# Altium schematic sheet SOC Power Pins.SchDoc: RK3399 SOM Module
size A3; Date: 23.05.2023; Author: Łukasz Nowarkiewicz; SheetNumber: 6; SheetTotal: 21; RegistrationBookNumber: 144201; title_sheet: SOC Power Pins
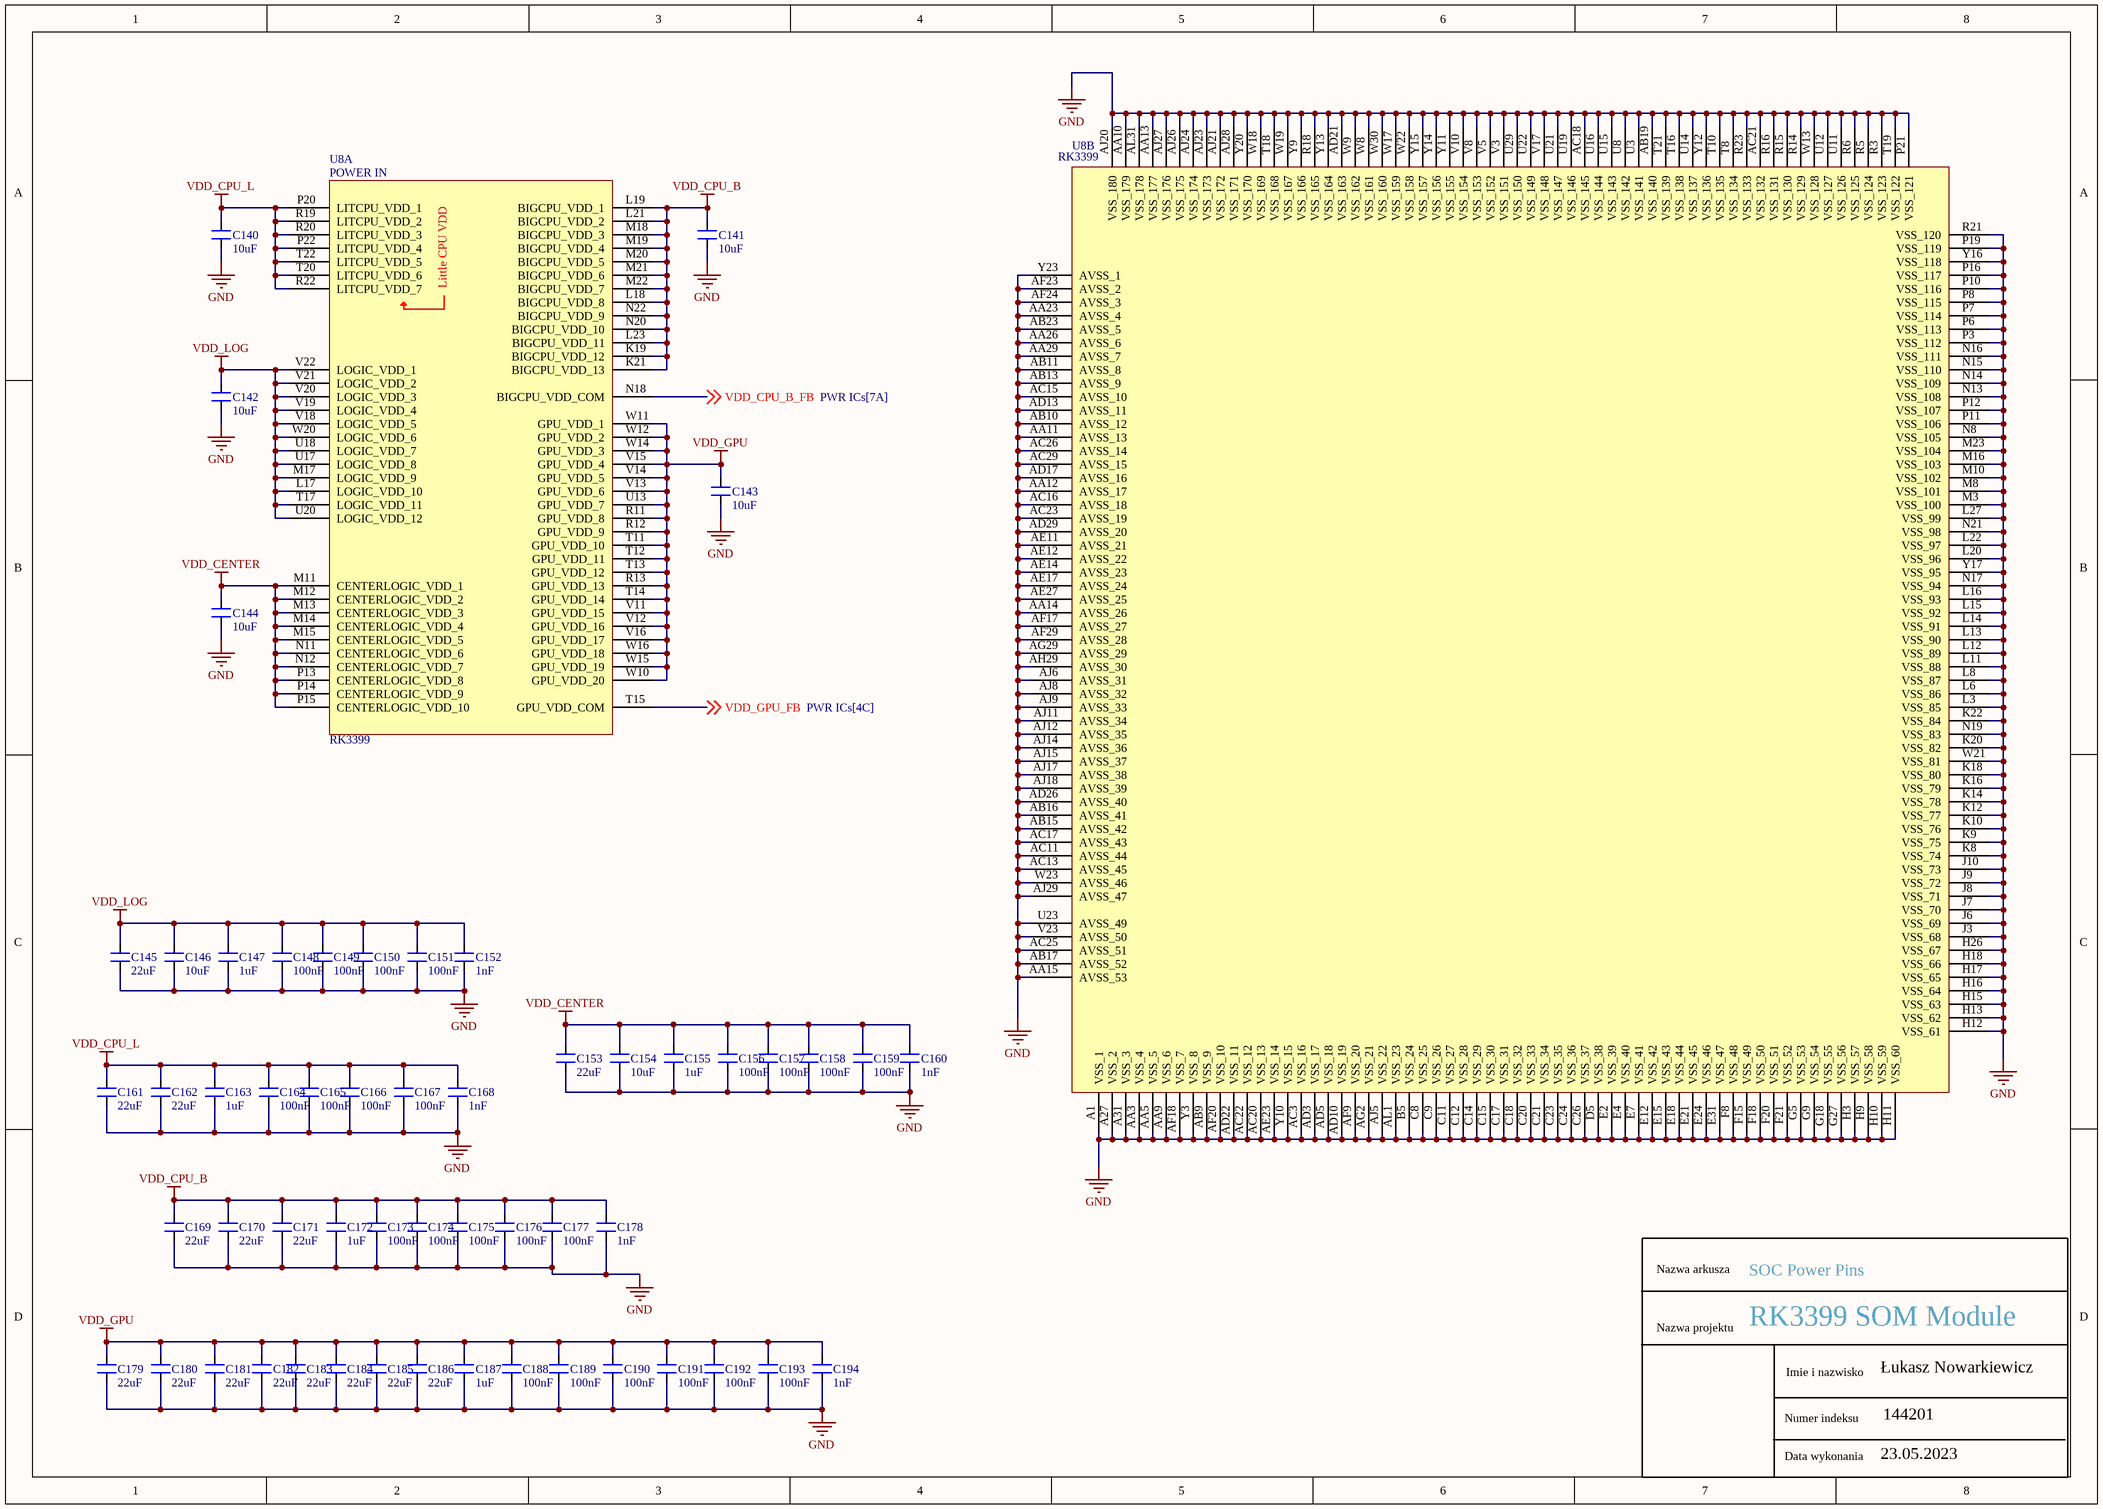
[diagram p0: SOC Power Pins.SchDoc]

## Parts
C140  10uF  [CAP_0402]
C141  10uF  [CAP_0402]
C142  10uF  [CAP_0402]
C143  10uF  [CAP_0402]
C144  10uF  [CAP_0402]
C145  22uF  [CAP_0402]
C146  10uF  [CAP_0402]
C147  1uF  [CAP_0201]
C148  100nF  [CAP_0201]
C149  100nF  [CAP_0201]
C150  100nF  [CAP_0201]
C151  100nF  [CAP_0201]
C152  1nF  [CAP_0201]
C153  22uF  [CAP_0402]
C154  10uF  [CAP_0402]
C155  1uF  [CAP_0201]
C156  100nF  [CAP_0201]
C157  100nF  [CAP_0201]
C158  100nF  [CAP_0201]
C159  100nF  [CAP_0201]
C160  1nF  [CAP_0201]
C161  22uF  [CAP_0402]
C162  22uF  [CAP_0402]
C163  1uF  [CAP_0201]
C164  100nF  [CAP_0201]
C165  100nF  [CAP_0201]
C166  100nF  [CAP_0201]
C167  100nF  [CAP_0201]
C168  1nF  [CAP_0201]
C169  22uF  [CAP_0402]
C170  22uF  [CAP_0402]
C171  22uF  [CAP_0402]
C172  1uF  [CAP_0201]
C173  100nF  [CAP_0201]
C174  100nF  [CAP_0201]
C175  100nF  [CAP_0201]
C176  100nF  [CAP_0201]
C177  100nF  [CAP_0201]
C178  1nF  [CAP_0201]
C179  22uF  [CAP_0402]
C180  22uF  [CAP_0402]
C181  22uF  [CAP_0402]
C182  22uF  [CAP_0402]
C183  22uF  [CAP_0402]
C184  22uF  [CAP_0402]
C185  22uF  [CAP_0402]
C186  22uF  [CAP_0402]
C187  1uF  [CAP_0201]
C188  100nF  [CAP_0201]
C189  100nF  [CAP_0201]
C190  100nF  [CAP_0201]
C191  100nF  [CAP_0201]
C192  100nF  [CAP_0201]
C193  100nF  [CAP_0201]
C194  1nF  [CAP_0201]
U8  RK3399  [FBGA828_23_826X826]  (parts A,B of 24)

## Nets
GND: C140.1 C141.1 C142.1 C143.1 C144.1 C145.1 C146.1 C147.1 C148.1 C149.1 C150.1 C151.1 C152.1 C153.1 C154.1 C155.1 C156.1 C157.1 C158.1 C159.1 C160.1 C161.1 C162.1 C163.1 C164.1 C165.1 C166.1 C167.1 C168.1 C169.1 C170.1 C171.1 C172.1 C173.1 C174.1 C175.1 C176.1 C177.1 C178.1 C179.1 C180.1 C181.1 C182.1 C183.1 C184.1 C185.1 C186.1 C187.1 C188.1 C189.1 C190.1 C191.1 C192.1 C193.1 C194.1 U8.A1(VSS_1) U8.A27(VSS_2) U8.A31(VSS_3) U8.AA3(VSS_4) U8.AA5(VSS_5) U8.AA9(VSS_6) U8.AA10(VSS_179) U8.AA11(AVSS_13) U8.AA12(AVSS_17) U8.AA13(VSS_177) U8.AA14(AVSS_26) U8.AA15(AVSS_53) U8.AA23(AVSS_4) U8.AA26(AVSS_6) U8.AA29(AVSS_7) U8.AB9(VSS_9) U8.AB10(AVSS_12) U8.AB11(AVSS_8) U8.AB13(AVSS_9) U8.AB15(AVSS_42) U8.AB16(AVSS_41) U8.AB17(AVSS_52) U8.AB19(VSS_140) U8.AB23(AVSS_5) U8.AC3(VSS_16) U8.AC11(AVSS_44) U8.AC13(AVSS_45) U8.AC15(AVSS_10) U8.AC16(AVSS_18) U8.AC17(AVSS_43) U8.AC18(VSS_145) U8.AC20(VSS_13) U8.AC21(VSS_132) U8.AC22(VSS_12) U8.AC23(AVSS_19) U8.AC25(AVSS_51) U8.AC26(AVSS_14) U8.AC29(AVSS_15) U8.AD3(VSS_17) U8.AD5(VSS_18) U8.AD10(VSS_19) U8.AD13(AVSS_11) U8.AD17(AVSS_16) U8.AD21(VSS_163) U8.AD22(VSS_11) U8.AD26(AVSS_40) U8.AD29(AVSS_20) U8.AE11(AVSS_21) U8.AE12(AVSS_22) U8.AE14(AVSS_23) U8.AE17(AVSS_24) U8.AE23(VSS_14) U8.AE27(AVSS_25) U8.AF9(VSS_20) U8.AF17(AVSS_27) U8.AF18(VSS_7) U8.AF20(VSS_10) U8.AF23(AVSS_2) U8.AF24(AVSS_3) U8.AF29(AVSS_28) U8.AG2(VSS_21) U8.AG29(AVSS_29) U8.AH29(AVSS_30) U8.AJ5(VSS_22) U8.AJ6(AVSS_31) U8.AJ8(AVSS_32) U8.AJ9(AVSS_33) U8.AJ11(AVSS_34) U8.AJ12(AVSS_35) U8.AJ14(AVSS_36) U8.AJ15(AVSS_37) U8.AJ17(AVSS_38) U8.AJ18(AVSS_39) U8.AJ20(VSS_180) U8.AJ21(VSS_172) U8.AJ23(VSS_173) U8.AJ24(VSS_174) U8.AJ26(VSS_175) U8.AJ27(VSS_176) U8.AJ28(VSS_171) U8.AJ29(AVSS_47) U8.AL1(VSS_23) U8.AL31(VSS_178) U8.B5(VSS_24) U8.C8(VSS_25) U8.C9(VSS_26) U8.C11(VSS_27) U8.C12(VSS_28) U8.C14(VSS_29) U8.C15(VSS_30) U8.C17(VSS_31) U8.C18(VSS_32) U8.C20(VSS_33) U8.C21(VSS_34) U8.C23(VSS_35) U8.C24(VSS_36) U8.C26(VSS_37) U8.D5(VSS_38) U8.E2(VSS_39) U8.E4(VSS_40) U8.E7(VSS_41) U8.E12(VSS_42) U8.E15(VSS_43) U8.E18(VSS_44) U8.E21(VSS_45) U8.E24(VSS_46) U8.E31(VSS_47) U8.F8(VSS_48) U8.F15(VSS_49) U8.F18(VSS_50) U8.F20(VSS_51) U8.F21(VSS_52) U8.G5(VSS_53) U8.G9(VSS_54) U8.G18(VSS_55) U8.G27(VSS_56) U8.H3(VSS_57) U8.H9(VSS_58) U8.H10(VSS_59) U8.H11(VSS_60) U8.H12(VSS_61) U8.H13(VSS_62) U8.H15(VSS_63) U8.H16(VSS_64) U8.H17(VSS_65) U8.H18(VSS_66) U8.H26(VSS_67) U8.J3(VSS_68) U8.J6(VSS_69) U8.J7(VSS_70) U8.J8(VSS_71) U8.J9(VSS_72) U8.J10(VSS_73) U8.K8(VSS_74) U8.K9(VSS_75) U8.K10(VSS_76) U8.K12(VSS_77) U8.K14(VSS_78) U8.K16(VSS_79) U8.K18(VSS_80) U8.K20(VSS_82) U8.K22(VSS_84) U8.L3(VSS_85) U8.L6(VSS_86) U8.L8(VSS_87) U8.L11(VSS_88) U8.L12(VSS_89) U8.L13(VSS_90) U8.L14(VSS_91) U8.L15(VSS_92) U8.L16(VSS_93) U8.L20(VSS_96) U8.L22(VSS_97) U8.L27(VSS_99) U8.M3(VSS_100) U8.M8(VSS_101) U8.M10(VSS_102) U8.M16(VSS_103) U8.M23(VSS_104) U8.N8(VSS_105) U8.N13(VSS_108) U8.N14(VSS_109) U8.N15(VSS_110) U8.N16(VSS_111) U8.N17(VSS_94) U8.N19(VSS_83) U8.N21(VSS_98) U8.P3(VSS_112) U8.P6(VSS_113) U8.P7(VSS_114) U8.P8(VSS_115) U8.P10(VSS_116) U8.P11(VSS_106) U8.P12(VSS_107) U8.P16(VSS_117) U8.P19(VSS_119) U8.P21(VSS_121) U8.R3(VSS_123) U8.R5(VSS_124) U8.R6(VSS_125) U8.R14(VSS_129) U8.R15(VSS_130) U8.R16(VSS_131) U8.R18(VSS_165) U8.R21(VSS_120) U8.R23(VSS_133) U8.T8(VSS_134) U8.T10(VSS_135) U8.T16(VSS_138) U8.T18(VSS_168) U8.T19(VSS_122) U8.T21(VSS_139) U8.U3(VSS_141) U8.U8(VSS_142) U8.U11(VSS_126) U8.U12(VSS_127) U8.U14(VSS_137) U8.U15(VSS_143) U8.U16(VSS_144) U8.U19(VSS_146) U8.U21(VSS_147) U8.U22(VSS_149) U8.U23(AVSS_49) U8.U29(VSS_150) U8.V3(VSS_151) U8.V5(VSS_152) U8.V8(VSS_153) U8.V10(VSS_154) U8.V17(VSS_148) U8.V23(AVSS_50) U8.W8(VSS_161) U8.W9(VSS_162) U8.W13(VSS_128) U8.W17(VSS_159) U8.W18(VSS_169) U8.W19(VSS_167) U8.W21(VSS_81) U8.W22(VSS_158) U8.W23(AVSS_46) U8.W30(VSS_160) U8.Y3(VSS_8) U8.Y9(VSS_166) U8.Y10(VSS_15) U8.Y11(VSS_155) U8.Y12(VSS_136) U8.Y13(VSS_164) U8.Y14(VSS_156) U8.Y15(VSS_157) U8.Y16(VSS_118) U8.Y17(VSS_95) U8.Y20(VSS_170) U8.Y23(AVSS_1)
VDD_CENTER: C144.2 C153.2 C154.2 C155.2 C156.2 C157.2 C158.2 C159.2 C160.2 U8.M11(CENTERLOGIC_VDD_1) U8.M12(CENTERLOGIC_VDD_2) U8.M13(CENTERLOGIC_VDD_3) U8.M14(CENTERLOGIC_VDD_4) U8.M15(CENTERLOGIC_VDD_5) U8.N11(CENTERLOGIC_VDD_6) U8.N12(CENTERLOGIC_VDD_7) U8.P13(CENTERLOGIC_VDD_8) U8.P14(CENTERLOGIC_VDD_9) U8.P15(CENTERLOGIC_VDD_10)
VDD_CPU_B: C141.2 C169.2 C170.2 C171.2 C172.2 C173.2 C174.2 C175.2 C176.2 C177.2 C178.2 U8.K19(BIGCPU_VDD_12) U8.K21(BIGCPU_VDD_13) U8.L18(BIGCPU_VDD_8) U8.L19(BIGCPU_VDD_1) U8.L21(BIGCPU_VDD_2) U8.L23(BIGCPU_VDD_11) U8.M18(BIGCPU_VDD_3) U8.M19(BIGCPU_VDD_4) U8.M20(BIGCPU_VDD_5) U8.M21(BIGCPU_VDD_6) U8.M22(BIGCPU_VDD_7) U8.N20(BIGCPU_VDD_10) U8.N22(BIGCPU_VDD_9)
VDD_CPU_L: C140.2 C161.2 C162.2 C163.2 C164.2 C165.2 C166.2 C167.2 C168.2 U8.P20(LITCPU_VDD_1) U8.P22(LITCPU_VDD_4) U8.R19(LITCPU_VDD_2) U8.R20(LITCPU_VDD_3) U8.R22(LITCPU_VDD_7) U8.T20(LITCPU_VDD_6) U8.T22(LITCPU_VDD_5)
VDD_GPU: C143.2 C179.2 C180.2 C181.2 C182.2 C183.2 C184.2 C185.2 C186.2 C187.2 C188.2 C189.2 C190.2 C191.2 C192.2 C193.2 C194.2 U8.R11(GPU_VDD_8) U8.R12(GPU_VDD_9) U8.R13(GPU_VDD_13) U8.T11(GPU_VDD_10) U8.T12(GPU_VDD_11) U8.T13(GPU_VDD_12) U8.T14(GPU_VDD_14) U8.U13(GPU_VDD_7) U8.V11(GPU_VDD_15) U8.V12(GPU_VDD_16) U8.V13(GPU_VDD_6) U8.V14(GPU_VDD_5) U8.V15(GPU_VDD_4) U8.V16(GPU_VDD_17) U8.W10(GPU_VDD_20) U8.W11(GPU_VDD_1) U8.W12(GPU_VDD_2) U8.W14(GPU_VDD_3) U8.W15(GPU_VDD_19) U8.W16(GPU_VDD_18)
VDD_LOG: C142.2 C145.2 C146.2 C147.2 C148.2 C149.2 C150.2 C151.2 C152.2 U8.L17(LOGIC_VDD_10) U8.M17(LOGIC_VDD_9) U8.T17(LOGIC_VDD_11) U8.U17(LOGIC_VDD_8) U8.U18(LOGIC_VDD_7) U8.U20(LOGIC_VDD_12) U8.V18(LOGIC_VDD_5) U8.V19(LOGIC_VDD_4) U8.V20(LOGIC_VDD_3) U8.V21(LOGIC_VDD_2) U8.V22(LOGIC_VDD_1) U8.W20(LOGIC_VDD_6)
VDD_CPU_B_FB: U8.N18(BIGCPU_VDD_COM) ; off-sheet VDD_CPU_B_FB
VDD_GPU_FB: U8.T15(GPU_VDD_COM) ; off-sheet VDD_GPU_FB

## Notes on the sheet
- Nazwa arkusza
- Nazwa projektu
- Imie i nazwisko
- Data wykonania
- Numer indeksu
- (in symbol IC_RK3399-FCBGA828, part A) POWER IN; Little CPU VDD

## Library data of the parts
C140-C144 C146 C154 = CAP_10uF-10V-20%-0402: 10µF ±20% 10V Ceramic Capacitor X5R 0402 (1005 Metric); Manufacturer Part Number: CL05A106MP5NUNC; Manufacturer: Samsung Electro-Mechanics; Case/Package: 0402; Supplier-1: Digikey
C145 C153 C161 C162 C169-C171 C179-C186 = CAP_22uF-6.3V-20%-0402: 22µF ±20% 6.3V Ceramic Capacitor X5R 0402 (1005 Metric); Manufacturer: Murata Electronics; Manufacturer Part Number: CL05A226MQ5N6J8; Case/Package: 0402; Supplier-1: Digikey
C147 C155 C163 C172 C187 = CAP_1uF-16V-10%-0201: 1µF ±20% 16V Ceramic Capacitor X5R 0201 (0603 Metric); Manufacturer: Samsung Electro-Mechanics; Manufacturer Part Number: CL03A105MO3NRNH; Case/Package: 0201; Supplier-1: Digikey
C148-C151 C156-C159 C164-C167 C173-C177 C188-C193 = CAP_100nF-25V-10%-0201: 0.1µF ±10% 25V Ceramic Capacitor X5R 0201 (0603 Metric); Manufacturer: TDK Corporation; Manufacturer Part Number: C0603X5R1E104K030BB; Case/Package: 0201; Supplier-1: Digikey
C152 C160 C168 C178 C194 = CAP_1nF-16V-10%-0201: 1000pF ±10% 16V Ceramic Capacitor X7R 0201 (0603 Metric); Manufacturer: Murata Electronics; Manufacturer Part Number: GRM033R71C102KA01D; Case/Package: 0201; Supplier-1: Digikey
U8 = IC_RK3399-FCBGA828: RK3399 is a low power, high performance processor for computing, personal mobile.; Manufacturer: Rockchip; Manufacturer Part Number: RK3399; Case/Package: FCBGA828; Supplier-1: Rockchip